# Altium schematic sheet Power.SchDoc
size A3; SheetNumber: 4; SheetTotal: 13
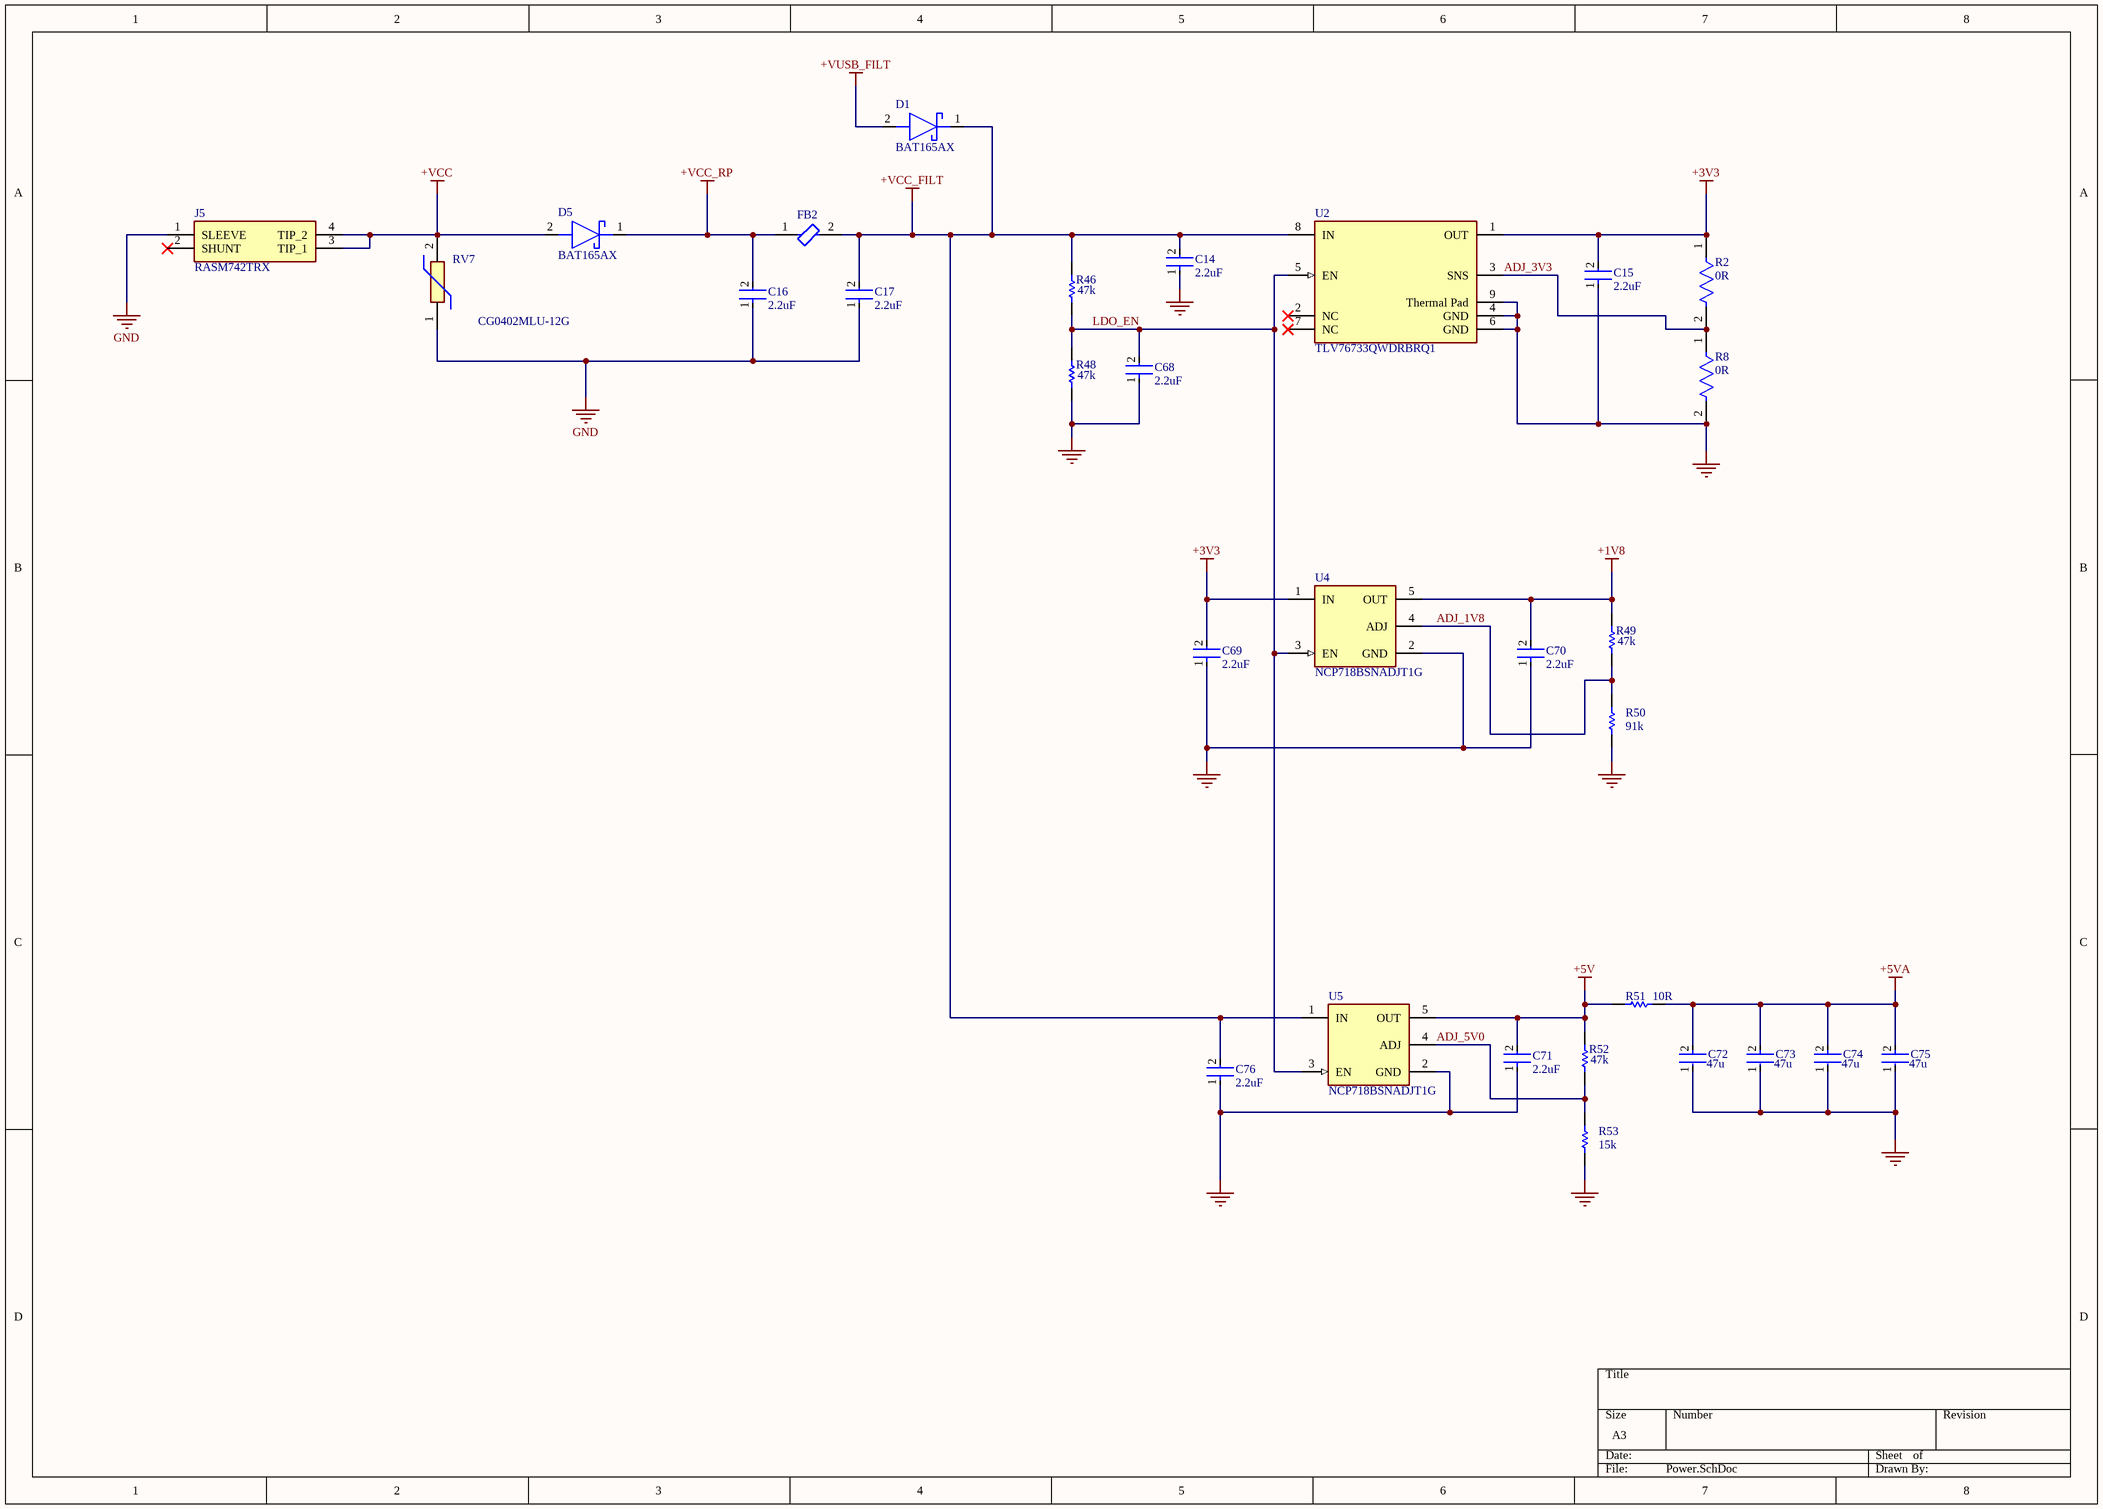
[diagram p0: Power.SchDoc]

## Parts
C14  Capacitance: 2.2uF  [FP-GCH188-0_1-e0_2_0_5-MFG]  (hidden comment: GCM188C71A225KE02D)
C15  Capacitance: 2.2uF  [FP-GCH188-0_1-e0_2_0_5-MFG]  (hidden comment: GCM188C71A225KE02D)
C16  Capacitance: 2.2uF  [FP-GCH188-0_1-e0_2_0_5-MFG]  (hidden comment: GCM188C71A225KE02D)
C17  Capacitance: 2.2uF  [FP-GCH188-0_1-e0_2_0_5-MFG]  (hidden comment: GCM188C71A225KE02D)
C68  Capacitance: 2.2uF  [FP-GCH188-0_1-e0_2_0_5-MFG]  (hidden comment: GCM188C71A225KE02D)
C69  Capacitance: 2.2uF  [FP-GCH188-0_1-e0_2_0_5-MFG]  (hidden comment: GCM188C71A225KE02D)
C70  Capacitance: 2.2uF  [FP-GCH188-0_1-e0_2_0_5-MFG]  (hidden comment: GCM188C71A225KE02D)
C71  Capacitance: 2.2uF  [FP-GCH188-0_1-e0_2_0_5-MFG]  (hidden comment: GCM188C71A225KE02D)
C72  Capacitance: 47u  [FP-GCM32E-0_3-MFG]  (hidden comment: GCM32EC71A476KE02K)
C73  Capacitance: 47u  [FP-GCM32E-0_3-MFG]  (hidden comment: GCM32EC71A476KE02K)
C74  Capacitance: 47u  [FP-GCM32E-0_3-MFG]  (hidden comment: GCM32EC71A476KE02K)
C75  Capacitance: 47u  [FP-GCM32E-0_3-MFG]  (hidden comment: GCM32EC71A476KE02K)
C76  Capacitance: 2.2uF  [FP-GCH188-0_1-e0_2_0_5-MFG]  (hidden comment: GCM188C71A225KE02D)
D1  BAT165AX  [BAT165AX]
D5  BAT165AX  [BAT165AX]
FB2  MPZ1005S121ET000  [FP-MPZ1005-MFG]  (value not drawn)
J5  RASM742TRX  [RASM742TRX]
R2  Resistance: 0R  [FP-RMCF0402-MFG]  (hidden comment: RMCF0402ZT0R00)
R8  Resistance: 0R  [FP-RMCF0402-MFG]  (hidden comment: RMCF0402ZT0R00)
R46  Resistance: 47k  [RESC1005X40X25LL05T10]  (hidden comment: RC0402JR-0747KL)
R48  Resistance: 47k  [RESC1005X40X25LL05T10]  (hidden comment: RC0402JR-0747KL)
R49  Resistance: 47k  [RESC1005X40X25LL05T10]  (hidden comment: RC0402JR-0747KL)
R50  Resistance: 91k  [RESC1005X40X25LL05T10]  (hidden comment: RC0402JR-0791KL)
R51  Resistance: 10R  [RESC1608X55X25LL10T15]  (hidden comment: RC0603JR-1310RL)
R52  Resistance: 47k  [RESC1005X40X25LL05T10]  (hidden comment: RC0402JR-0747KL)
R53  Resistance: 15k  [RESC1005X40X25NL05T10]  (hidden comment: RC0402JR-0715KL)
RV7  CG0402MLU-12G  [VARC1005X41N]
U2  TLV76733QWDRBRQ1  [FP-DRB0008J-IPC_C]
U4  NCP718BSNADJT1G  [FP-419AE-01-IPC_C]
U5  NCP718BSNADJT1G  [FP-419AE-01-IPC_C]

## Nets
+1V8: C70.2 R49.2 U4.5(OUT)
+3V3: C15.2 C69.2 R2.1 U2.1(OUT) U4.1(IN)
+5V: C71.2 R51.1 R52.2 U5.5(OUT)
+5VA: C72.2 C73.2 C74.2 C75.2 R51.2
+VCC: D5.2(A) J5.3(TIP_1) J5.4(TIP_2) RV7.2
+VCC_FILT: C14.2 C17.2 C76.2 D1.1(K) FB2.2 R46.2 U2.8(IN) U5.1(IN)
+VCC_RP: C16.2 D5.1(K) FB2.1
+VUSB_FILT: D1.2(A)
GND: C14.1 C15.1 C16.1 C17.1 C68.1 C69.1 C70.1 C71.1 C72.1 C73.1 C74.1 C75.1 C76.1 J5.1(SLEEVE) R8.2 R48.1 R50.1 R53.1 RV7.1 U2.4(GND) U2.6(GND) U2.9(Thermal_Pad) U4.2(GND) U5.2(GND)
ADJ_1V8: R49.1 R50.2 U4.4(ADJ)
ADJ_3V3: R2.2 R8.1 U2.3(SNS)
ADJ_5V0: R52.1 R53.2 U5.4(ADJ)
LDO_EN: C68.2 R46.1 R48.2 U2.5(EN) U4.3(EN) U5.3(EN)

Not connected (* = marked no-connect by the designer): J5 2(SHUNT)*; U2 2(NC)* 7(NC)*

## Library data of the parts
C14-C17 C68-C71 C76 = CMP-00260-57357036-1: GCM188C71A225KE02D Multilayer Ceramic Capacitor, 2.2 uF, 10 V, ± 10%, X7S, 0603 [1608 Metric]; NexarPartId: 57357036; RoHS: Non-Compliant; Lifecycle Status: Production
C72-C75 = CMP-06035-055308-1: Ceramic Capacitor for Automotive 47uF ±10% 10VDC X7S 1210 Embossed T/R
D1 D5 = BAT165AX: Schottky Diode; Manufacturer_Name: Nexperia; Datasheet Link: https://assets.nexperia.com/documents/data-sheet/BAT165A.pdf; Height: 1.1mm; Manufacturer_Part_Number: BAT165AX; Mouser Part Number: 771-BAT165AX; Mouser Price/Stock: https://www.mouser.co.uk/ProductDetail/Nexperia/BAT165AX?qs=1fQ7IOp4WriMQ9TlJoQ5jw%3D%3D; Arrow Part Number: BAT165AX; Arrow Price/Stock: https://www.arrow.com/en/products/bat165ax/nexperia?utm_currency=USD&region=nac
FB2 = CMP-08257-000274-1: Power line Ferrite Bead 120Ω @ 100MHz 1.5A DCR 0.095Ω SMD 0402; Tolerance: 25%; Number of Lines: 1; Impedance: 120R; DC Resistance (DCR): 95mR; RoHS Compliant: Yes; Test Frequency: 100MHz; Length: 0.039inch; Case Code (Metric): 1005; Case/Package: 0402; Max Operating Temperature: 125°C; Max Current Rating: 1.5A; Termination: SMD/SMT; Case Code (Imperial): 0402; Width: 0.02inch; Weight: 2.3E-05oz; Max DC Current: 1.5A; Height: 0.022inch; Package Quantity: 10000; Mount: Surface Mount; Min Operating Temperature: -55°C; Packaging: Tape and Reel
J5 = RASM742TRX: Connector; Manufacturer_Name: Switchcraft; Datasheet Link: https://www.mouser.ph/ProductDetail/Switchcraft/RASM742TRX?qs=mcPJWgAPNrdcPY6U4InXHg%3D%3D&srsltid=AfmBOooMj0kEPMqk1k0gwFmsjJjNoSaW62hNPqqtUxzbBym_46hZI4RS; Height: 5.334mm; Manufacturer_Part_Number: RASM742TRX; Mouser Part Number: 502-RASM742TRX; Mouser Price/Stock: https://www.mouser.co.uk/ProductDetail/Switchcraft/RASM742TRX?qs=mcPJWgAPNrdcPY6U4InXHg%3D%3D; Arrow Part Number: RASM742TRX; Arrow Price/Stock: https://www.arrow.com/en/products/rasm742trx/switchcraft?region=nac
R2 R8 = CMP-26527-007617-1: RES 0 OHM JUMPER 1/16W 0402; Power Rating: 63mW; Working Voltage: 50V; Current Rating: 1A; Series: RMCF; RoHS Compliant: Yes; Features: Automotive AEC-Q200; Width: 0.02inch; Depth: 0.5mm; Resistor Type: Thick Film; Number of Terminations: 2; Radiation Hardening: No; Length: 0.039inch; Contact Plating: Tin; Case/Package: 0402; Min Operating Temperature: -55°C; Case Code (Metric): 1005; Construction: Rectangular; Mount: Surface Mount; Max Operating Temperature: 155°C; Max Power Dissipation: 63mW; Height: 0.016inch; Lead Free: Lead Free; Packaging: Tape and Reel; Technology: THICK FILM; Case Code (Imperial): 0402; Military Standard: Not
R46 R48 R49 R52 = CMP-1011-00114-2: Manufacturer: Yageo / Phycomp; Part Number: RC0402JR-0747KL
R50 = CMP-2002-07162-1: Manufacturer: Yageo / Phycomp; Part Number: RC0402JR-0791KL
R51 = CMP-2000-04315-1: Manufacturer: Yageo; Part Number: RC0603JR-1310RL
R53 = CMP-2002-07928-1: Manufacturer: Yageo / Phycomp; Part Number: RC0402JR-0715KL
RV7 = CG0402MLU-12G: Varistor; Manufacturer_Name: Bourns; Datasheet Link: https://bourns.com/docs/product-datasheets/mlu.pdf?sfvrsn=1940d498_27; Height: 0.41mm; Manufacturer_Part_Number: CG0402MLU-12G; Mouser Part Number: 652-CG0402MLU-12G; Mouser Price/Stock: https://www.mouser.co.uk/ProductDetail/Bourns/CG0402MLU-12G?qs=m8myXnDJXpUNz33UIHxVhA%3D%3D; Arrow Part Number: CG0402MLU-12G; Arrow Price/Stock: https://www.arrow.com/en/products/cg0402mlu-12g/bourns?utm_currency=USD&region=nac
U2 = CMP-04917-000370-1: IC OPAMP; RoHS Compliant: Yes
U4 U5 = CMP-07128-000004-1: 300 MA LOW IQ WIDE INPUT; Manufacturer: On Semiconductor; Max Supply Voltage: 24V; Output Type: AdjustableProgrammable; Min Supply Voltage: 2.5V; Max Junction Temp: +125°C; Nominal Supply Current: 50-300uA; Dropout Voltage: 480mV; Accuracy Percentage: 2%; Standoff Height: 0.01mm; Output Voltage: 1.2-5V; Number Of Outputs: 1; Output Current: 300mA; Lead Free: Yes; Temperature: to +125°C; ComponentLink2URL: https://www.onsemi.com/pub/Collateral/NCP718-D.PDF; Height: 1mm; ComponentLink2Description: Datasheet; Octopart: https://octopart.com/ncp718bsnadjt1g-on+semiconductor-87658781; Manufacturer Part Number: NCP718BSNADJT1G; Device Class L1: Integrated Circuits (ICs); Device Class L2: Power Management ICs; Device Class L3: Voltage Regulators - Linear; Digikey Description: 300 MA LOW IQ WIDE INPUT; Temperature Range High: +125°C; Package: 419AE-01; Mouser Description: LDO Regulator, 300 mA, Wide Vin, Ultra-Low Iq Adjustable, Non-Active Discharge, TSOT23-5; Category: IC; Automotive: No; RoHS: TRUE